# EAGLE design eib-64-nanoz-adapter (EAGLE 8.3.2)
DESIGNER: JPN@MIT; DESIGN_NAME: EIB-64 NanoZ Adapter; LICENSE: CERN OHL v1.2; REVISION: 1.1
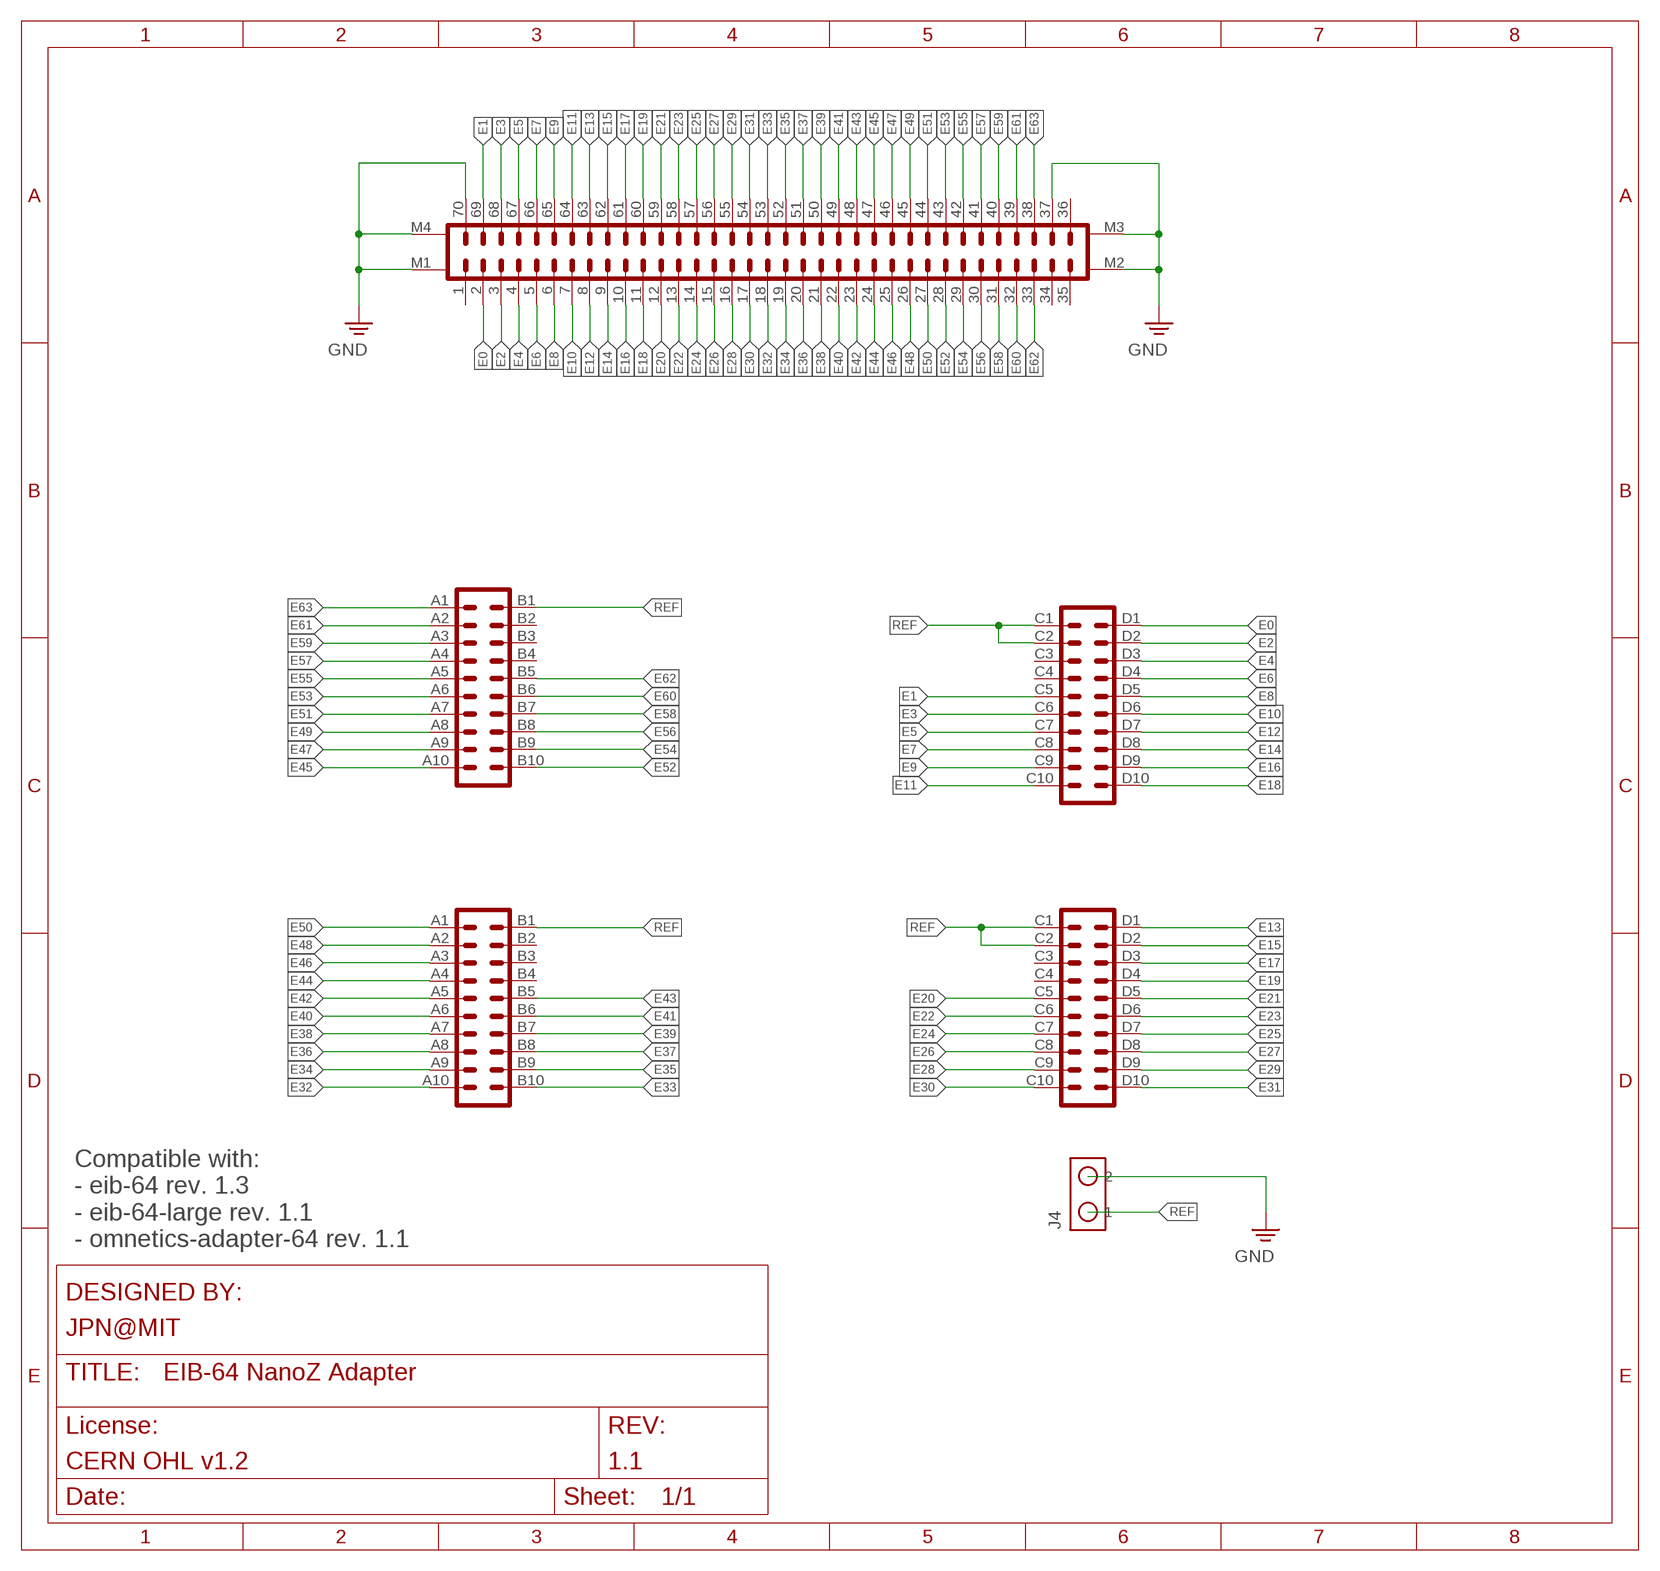
[diagram p0: schematic, sheet 1]

## Parts
J1  DF40-REC  PINHD-2X35+4_DF40-70HEAD  [DF40-70HEAD]
J2  PINHD-4X10_MOLC-THRU  [MOLC-110-11-S-Q]
J3  PINHD-4X10_MOLC-THRU  [MOLC-110-11-S-Q]
J4  SCREW2  [SCREW2]

## Nets
E0: J1.2 J2.D1
E1: J1.69 J2.C5
E2: J1.3 J2.D2
E3: J1.68 J2.C6
E4: J1.4 J2.D3
E5: J1.67 J2.C7
E6: J1.5 J2.D4
E7: J1.66 J2.C8
E8: J1.6 J2.D5
E9: J1.65 J2.C9
E10: J1.7 J2.D6
E11: J1.64 J2.C10
E12: J1.8 J2.D7
E13: J1.63 J3.D1
E14: J1.9 J2.D8
E15: J1.62 J3.D2
E16: J1.10 J2.D9
E17: J1.61 J3.D3
E18: J1.11 J2.D10
E19: J1.60 J3.D4
E20: J1.12 J3.C5
E21: J1.59 J3.D5
E22: J1.13 J3.C6
E23: J1.58 J3.D6
E24: J1.14 J3.C7
E25: J1.57 J3.D7
E26: J1.15 J3.C8
E27: J1.56 J3.D8
E28: J1.16 J3.C9
E29: J1.55 J3.D9
E30: J1.17 J3.C10
E31: J1.54 J3.D10
E32: J1.18 J3.A10
E33: J1.53 J3.B10
E34: J1.19 J3.A9
E35: J1.52 J3.B9
E36: J1.20 J3.A8
E37: J1.51 J3.B8
E38: J1.21 J3.A7
E39: J1.50 J3.B7
E40: J1.22 J3.A6
E41: J1.49 J3.B6
E42: J1.23 J3.A5
E43: J1.48 J3.B5
E44: J1.24 J3.A4
E45: J1.47 J2.A10
E46: J1.25 J3.A3
E47: J1.46 J2.A9
E48: J1.26 J3.A2
E49: J1.45 J2.A8
E50: J1.27 J3.A1
E51: J1.44 J2.A7
E52: J1.28 J2.B10
E53: J1.43 J2.A6
E54: J1.29 J2.B9
E55: J1.42 J2.A5
E56: J1.30 J2.B8
E57: J1.41 J2.A4
E58: J1.31 J2.B7
E59: J1.40 J2.A3
E60: J1.32 J2.B6
E61: J1.39 J2.A2
E62: J1.33 J2.B5
E63: J1.38 J2.A1
GND: J1.37 J1.70 J1.M1 J1.M2 J1.M3 J1.M4 J4.P$2
REF: J2.B1 J2.C1 J2.C2 J3.B1 J3.C1 J3.C2 J4.P$1
Unconnected: J1.1 J1.34 J1.35 J1.36 J2.B2 J2.B3 J2.B4 J2.C3 J2.C4 J3.B2 J3.B3 J3.B4 J3.C3 J3.C4

## Notes on the sheet
- Compatible with:
  - eib-64 rev. 1.3
  - eib-64-large rev. 1.1
  - omnetics-adapter-64 rev. 1.1

## Library data of the parts
J1 = jonnew:PINHD-2X35+4
J2 J3 = jonnew:PINHD-4X10
J4 = jonnew:SCREW2: Screw Terminal

## Net classes
1 thick: width 0.102 mm

## Board
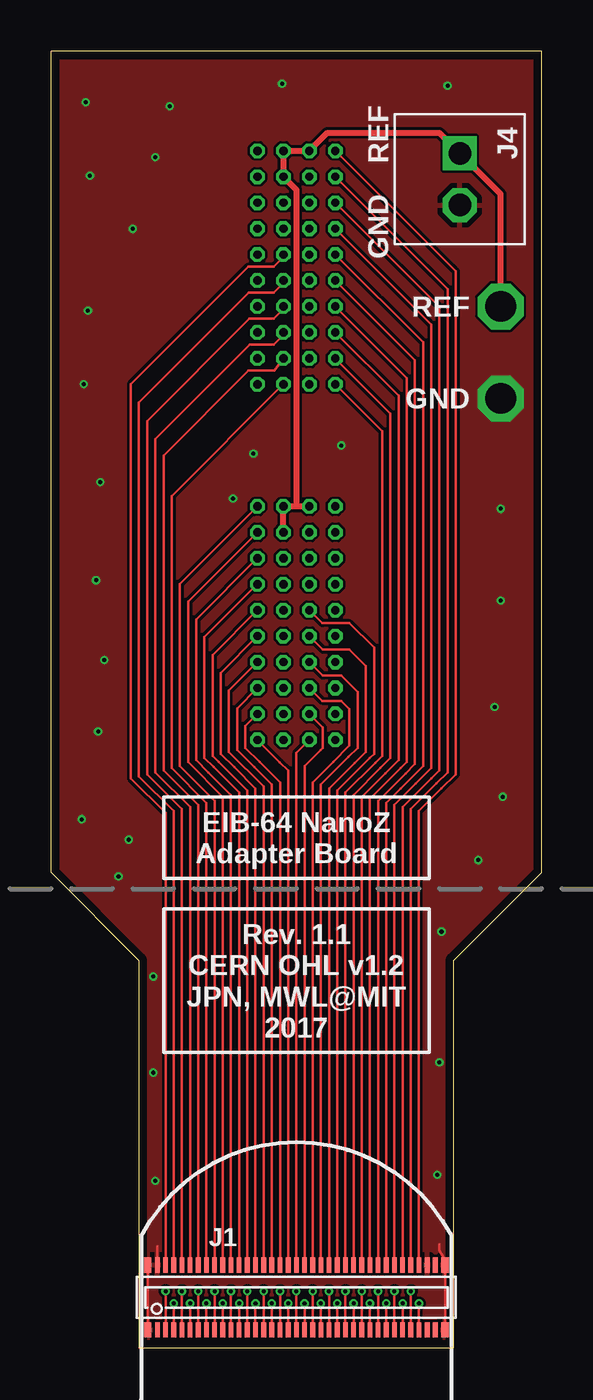
[diagram p1: board, top side]
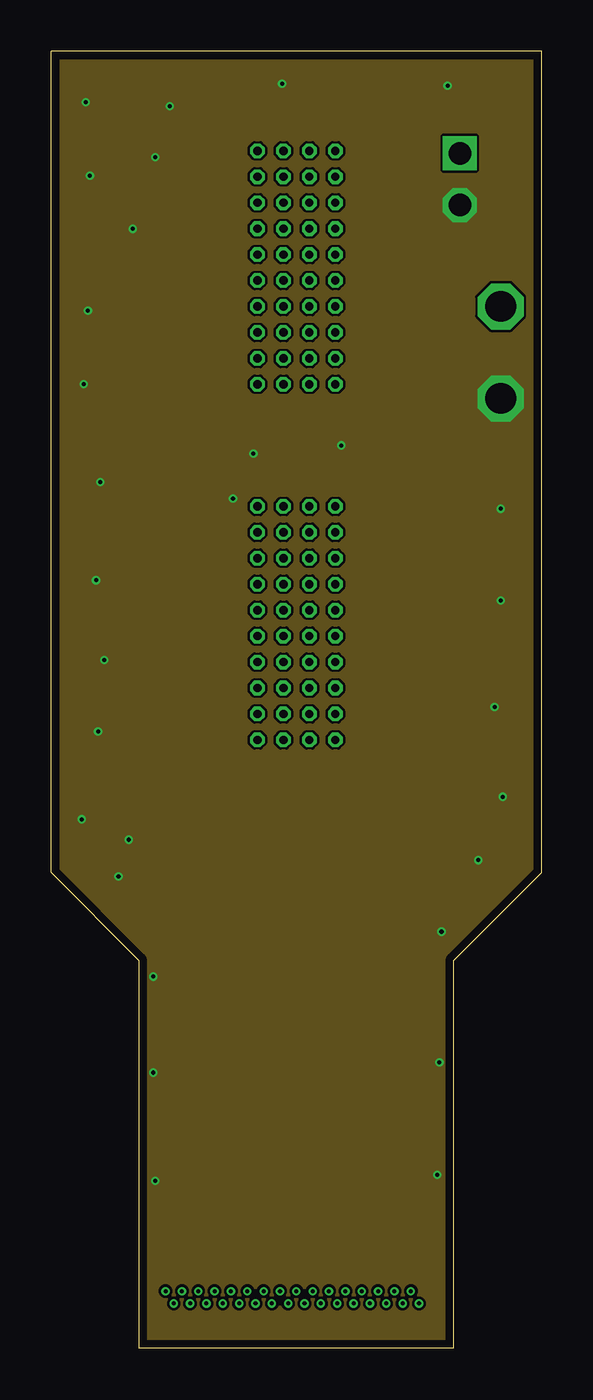
[diagram p2: board, inner layer Route2]
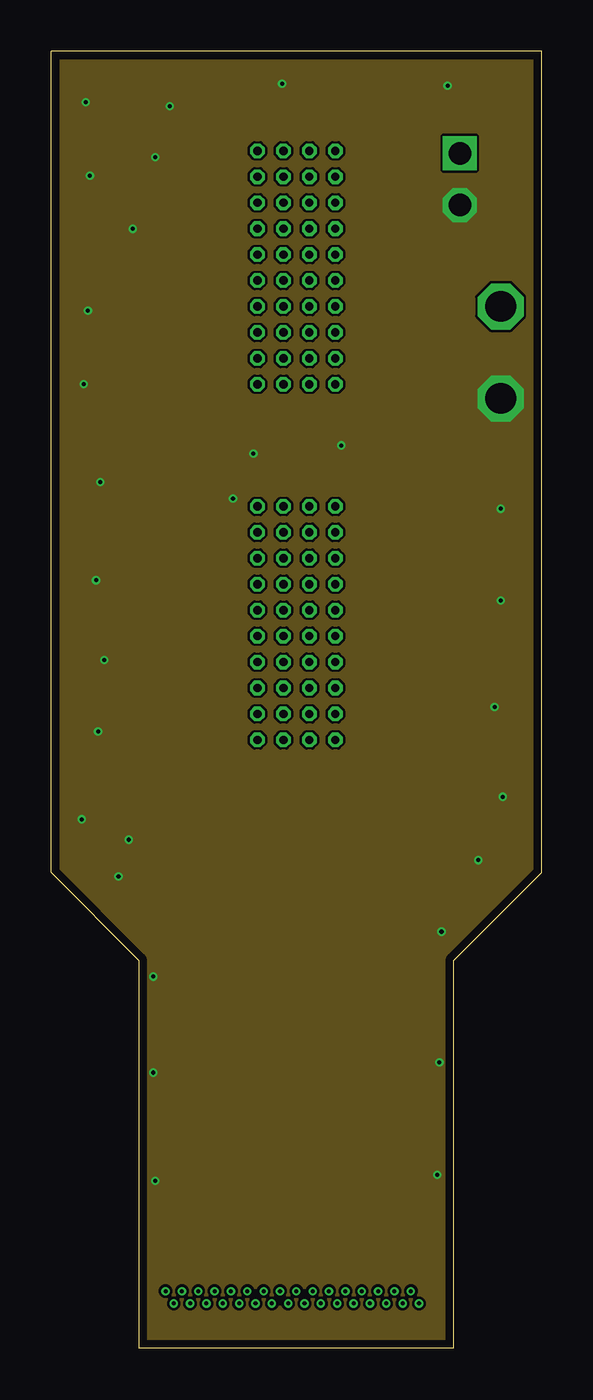
[diagram p3: board, inner layer Route15]
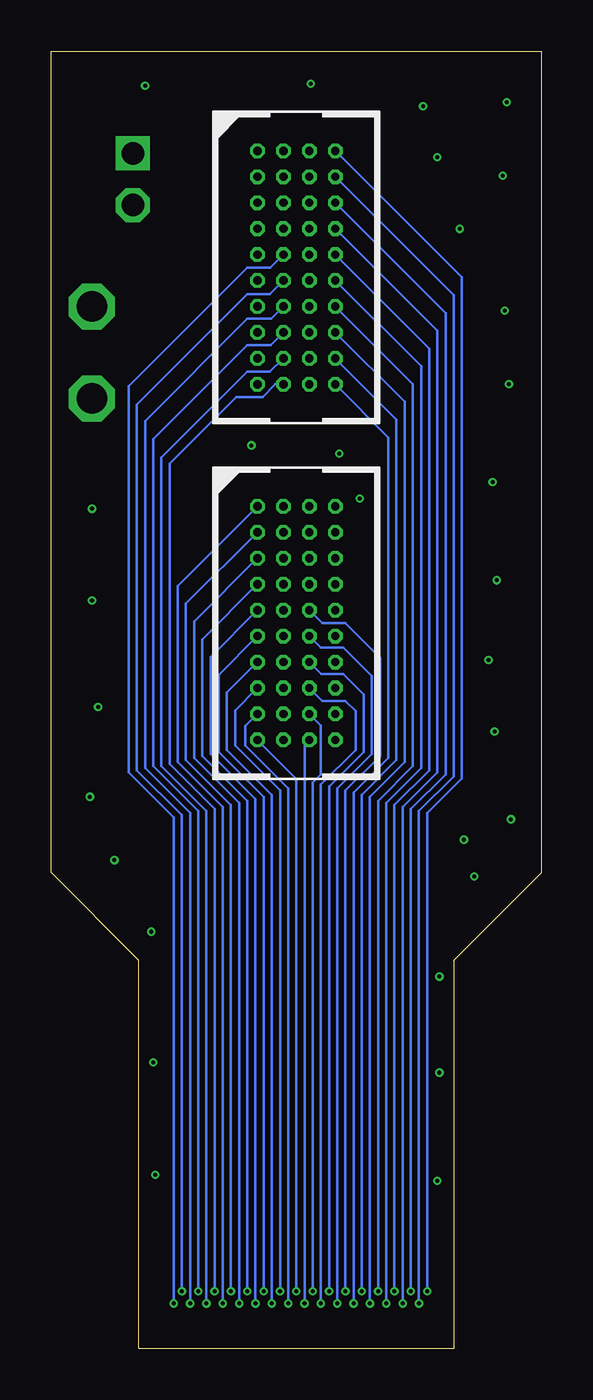
[diagram p4: board, bottom side, seen from below]

Size 24 x 63.5 mm. Coordinates in mm from the lower left corner, seen from the top.
Outline: 19.7,0 19.7,19 24,23.3 24,63.5 0,63.5 0,23.3 4.3,19 4.3,0 19.7,0
Copper layers (1*2*15*16): Top 0.035mm / dielectric 0.2mm / Route2 0.0175mm / dielectric 0.3mm / Route15 0.0175mm / dielectric 0.2mm / Bottom 0.035mm
Design rules "seeed-studio-4-layer *": minimum track width 5mil, minimum drill 0.2mm, track to track 5mil, track to pad 5mil, pad to pad 5mil, via to via 5mil, smd to smd 0mil, copper to edge 0.4mm, drill to drill 10mil, minimum pad ring 6mil, minimum via ring 4mil, stop-mask expansion 4mil, vias tented up to drill 100mil, thermal gap 10mil

### Footprints (pad centres in the part's own frame; a part is rotated, then mirrored left to right if it is on the bottom)
DF40-70HEAD = smd 0.23 x 0.75: 1 -6.8,-1.585; 2 -6.4,-1.585; 3 -6,-1.585; 4 -5.6,-1.585; 5 -5.2,-1.585; 6 -4.8,-1.585; 7 -4.4,-1.585; 8 -4,-1.585; 9 -3.6,-1.585; 10 -3.2,-1.585; 11 -2.8,-1.585; 12 -2.4,-1.585; 13 -2,-1.585; 14 -1.6,-1.585; 15 -1.2,-1.585; 16 -0.8,-1.585; 17 -0.4,-1.585; 18 0,-1.585; 19 0.4,-1.585; 20 0.8,-1.585; 21 1.2,-1.585; 22 1.6,-1.585; 23 2,-1.585; 24 2.4,-1.585; 25 2.8,-1.585; 26 3.2,-1.585; 27 3.6,-1.585; 28 4,-1.585; 29 4.4,-1.585; 30 4.8,-1.585; 31 5.2,-1.585; 32 5.6,-1.585; 33 6,-1.585; 34 6.4,-1.585; 35 6.8,-1.585; 36 6.8,1.585; 37 6.4,1.585; 38 6,1.585; 39 5.6,1.585; 40 5.2,1.585; 41 4.8,1.585; 42 4.4,1.585; 43 4,1.585; 44 3.6,1.585; 45 3.2,1.585; 46 2.8,1.585; 47 2.4,1.585; 48 2,1.585; 49 1.6,1.585; 50 1.2,1.585; 51 0.8,1.585; 52 0.4,1.585; 53 0,1.585; 54 -0.4,1.585; 55 -0.8,1.585; 56 -1.2,1.585; 57 -1.6,1.585; 58 -2,1.585; 59 -2.4,1.585; 60 -2.8,1.585; 61 -3.2,1.585; 62 -3.6,1.585; 63 -4,1.585; 64 -4.4,1.585; 65 -4.8,1.585; 66 -5.2,1.585; 67 -5.6,1.585; 68 -6,1.585; 69 -6.4,1.585; 70 -6.8,1.585 | smd 0.35 x 0.75: M1 -7.275,-1.585; M2 7.275,-1.585; M3 7.275,1.585; M4 -7.275,1.585
MOLC-110-11-S-Q = drill 0.406 octagon: A1 -1.905,5.715; A2 -1.905,4.445; A3 -1.905,3.175; A4 -1.905,1.905; A5 -1.905,0.635; A6 -1.905,-0.635; A7 -1.905,-1.905; A8 -1.905,-3.175; A9 -1.905,-4.445; A10 -1.905,-5.715; B1 -0.635,5.715; B2 -0.635,4.445; B3 -0.635,3.175; B4 -0.635,1.905; B5 -0.635,0.635; B6 -0.635,-0.635; B7 -0.635,-1.905; B8 -0.635,-3.175; B9 -0.635,-4.445; B10 -0.635,-5.715; C1 0.635,5.715; C2 0.635,4.445; C3 0.635,3.175; C4 0.635,1.905; C5 0.635,0.635; C6 0.635,-0.635; C7 0.635,-1.905; C8 0.635,-3.175; C9 0.635,-4.445; C10 0.635,-5.715; D1 1.905,5.715; D2 1.905,4.445; D3 1.905,3.175; D4 1.905,1.905; D5 1.905,0.635; D6 1.905,-0.635; D7 1.905,-1.905; D8 1.905,-3.175; D9 1.905,-4.445; D10 1.905,-5.715
SCREW2 = drill 1.1 square: P$1 0,0 | drill 1.1 octagon: P$2 2.54,0

### Placement (x,y rotation side)
J1  12,2.5 0 top
J2  12,52.9 0 bottom
J3  12,35.5 0 bottom
J4  20,58.5 270 top

### Tracks (layer width: path | path; a pad name or v marks a point on that pad's centre or on a via)
E0  (via drill 0.2)
  Top 0.127: v5.6,2.8 J1.2
  Bottom 0.127: J2.D1 3.9,52.42 3.9,27.9 5.6,26.2 v5.6,2.8
E1
  Top 0.127: J2.C5 11.49,53.54 10.89,52.94 9.64,52.94 3.9,47.2 3.9,27.9 5.6,26.2 J1.69
E2  (via drill 0.2)
  Top 0.127: v6,2.2 J1.3
  Bottom 0.127: J2.D2 4.3,51.55 4.3,28 6,26.3 v6,2.2
E3
  Top 0.127: J2.C6 11.49,52.27 10.89,51.67 9.67,51.67 4.3,46.3 4.3,28 6,26.3 J1.68
E4  (via drill 0.2)
  Top 0.127: J1.4 v6.4,2.8
  Bottom 0.127: J2.D3 4.7,50.68 4.7,28.1 6.4,26.4 v6.4,2.8
E5
  Top 0.127: J2.C7 11.49,51 10.89,50.4 9.7,50.4 4.7,45.4 4.7,28.1 | 4.7,28.1 6.4,26.4 | J1.67 6.4,26.4 | 6.4,26.4 4.7,28.1
E6  (via drill 0.2)
  Top 0.127: J1.5 v6.8,2.2
  Bottom 0.127: J2.D4 5.1,49.81 5.1,28.2 6.8,26.5 v6.8,2.2
E7
  Top 0.127: J2.C8 11.49,49.73 10.89,49.13 9.73,49.13 5.1,44.5 5.1,28.2 | 5.1,28.2 6.8,26.5 | J1.66 6.8,26.5 | 6.8,26.5 5.1,28.2
E8  (via drill 0.2)
  Top 0.127: J1.6 v7.2,2.8
  Bottom 0.127: J2.D5 5.5,48.94 5.5,28.3 7.2,26.6 v7.2,2.8
E9
  Top 0.127: J2.C9 10.93,47.86 9.66,47.86 5.5,43.7 5.5,28.3 7.2,26.6 J1.65
E10  (via drill 0.2)
  Top 0.127: J1.7 v7.6,2.2
  Bottom 0.127: J2.D6 5.9,48.07 5.9,28.4 7.6,26.7 v7.6,2.2
E11
  Top 0.127: J2.C10 5.9,41.72 5.9,28.4 7.6,26.7 J1.64
E12  (via drill 0.2)
  Top 0.127: J1.8 v8,2.8
  Bottom 0.127: J2.D7 6.3,47.2 6.3,28.5 8,26.8 v8,2.8
E13
  Top 0.127: J3.D1 6.3,37.42 6.3,28.5 8,26.8 J1.63
E14  (via drill 0.2)
  Top 0.127: J1.9 v8.4,2.2
  Bottom 0.127: J2.D8 6.7,46.33 6.7,28.7 8.4,27 v8.4,2.2
E15
  Top 0.127: J3.D2 6.7,36.55 6.7,28.7 8.4,27 J1.62
E16  (via drill 0.2)
  Top 0.127: J1.10 v8.8,2.8
  Bottom 0.127: 8.8,5 8.8,27.1 7.1,28.8 7.1,45.46 J2.D9 | 8.8,5 8.8,4.9 | v8.8,2.8 8.8,5
E17
  Top 0.127: J3.D3 7.1,35.68 7.1,28.8 7.7,28.2 | 7.7,28.2 8.8,27.1 | J1.61 8.8,27.1 | 8.8,27.1 7.7,28.2
E18  (via drill 0.2)
  Top 0.127: J1.11 v9.2,2.2
  Bottom 0.127: J2.D10 7.5,44.59 7.5,28.9 9.2,27.2 v9.2,2.2
E19
  Top 0.127: J3.D4 7.5,34.81 7.5,28.9 7.95,28.45 | 7.95,28.45 9.2,27.2 | J1.60 9.2,27.2 | 9.2,27.2 7.95,28.45
E20  (via drill 0.2)
  Top 0.127: J1.12 v9.6,2.8
  Bottom 0.127: J3.C5 10.73,35.5 9.6,35.5 7.9,33.8 7.9,29 9.6,27.3 v9.6,2.8
E21
  Top 0.127: J3.D5 7.9,33.94 7.9,29 8.2,28.7 | 8.2,28.7 9.6,27.3 | J1.59 9.6,27.3 | 9.6,27.3 8.2,28.7
E22  (via drill 0.2)
  Top 0.127: J1.13 v10,2.2
  Bottom 0.127: J3.C6 10.8,34.3 9.7,34.3 8.3,32.9 8.3,29.1 10,27.4 v10,2.2
E23
  Top 0.127: J3.D6 8.3,33.07 8.3,29.1 8.95,28.45 | 8.95,28.45 10,27.4 | J1.58 10,27.4 | 10,27.4 8.95,28.45
E24  (via drill 0.2)
  Top 0.127: J1.14 v10.4,2.8
  Bottom 0.127: J3.C7 10.77,33 9.7,33 8.7,32 8.7,29.2 10.4,27.5 v10.4,2.8
E25
  Top 0.127: J3.D7 8.7,32.2 8.7,29.2 | 8.7,29.2 10.4,27.5 | J1.57 10.4,27.5 | 10.4,27.5 8.7,29.2
E26  (via drill 0.2)
  Top 0.127: J1.15 v10.8,2.2
  Bottom 0.127: J3.C8 10.74,31.7 9.6,31.7 9.1,31.2 9.1,29.3 10.8,27.6 v10.8,2.2
E27
  Top 0.127: J3.D8 9.1,31.33 9.1,29.3 9.95,28.45 | 9.95,28.45 10.8,27.6 | J1.56 10.8,27.6 | 10.8,27.6 9.95,28.45
E28  (via drill 0.2)
  Top 0.127: J1.16 v11.2,2.8
  Bottom 0.127: J3.C9 10.8,30.49 10.8,28.1 11.2,27.7 v11.2,2.8
E29
  Top 0.127: J3.D9 9.5,30.46 9.5,29.4 10.2,28.7 | 10.2,28.7 11.2,27.7 | J1.55 11.2,27.7 | 11.2,27.7 10.2,28.7
E30  (via drill 0.2)
  Top 0.127: J1.17 v11.6,2.2
  Bottom 0.127: J3.C10 11.6,29.55 v11.6,2.2
E31
  Top 0.127: 11.19,28.69 J3.D10 | 11.19,28.69 11.6,28.28 | J1.54 11.6,28.28 | 11.6,28.28 11.19,28.69
E32  (via drill 0.2)
  Top 0.127: J1.18 v12,2.8
  Bottom 0.127: J3.A10 12,27.88 v12,2.8
E33
  Top 0.127: 12,29.15 J3.B10 12,29.15 | J1.53 12,29.15
E34  (via drill 0.2)
  Top 0.127: J1.19 v12.4,2.2
  Bottom 0.127: J3.A9 14.5,30.46 14.5,29.5 12.4,27.4 v12.4,2.2
E35
  Top 0.127: J3.B9 13.3,30.39 13.3,29.4 13.2,29.3 | 13.2,29.3 12.4,28.5 | J1.52 12.4,28.5 | 12.4,28.5 13.2,29.3
E36  (via drill 0.2)
  Top 0.127: J1.20 v12.8,2.8
  Bottom 0.127: J3.A8 15,31.23 15,29.5 12.8,27.3 v12.8,2.8
E37
  Top 0.127: J3.B8 13.26,31.7 14.2,31.7 14.6,31.3 14.6,29.5 13.8,28.7 | 13.8,28.7 12.8,27.7 | J1.51 12.8,27.7 | 12.8,27.7 13.8,28.7
E38  (via drill 0.2)
  Top 0.127: J1.21 v13.2,2.2
  Bottom 0.127: J3.A7 15.4,32.1 15.4,29.3 13.2,27.1 v13.2,2.2
E39
  Top 0.127: J3.B7 13.29,32.94 14.2,32.94 15,32.13 15,29.4 14.55,28.95 | 14.55,28.95 13.2,27.6 | J1.50 13.2,27.6 | 13.2,27.6 14.55,28.95
E40  (via drill 0.2)
  Top 0.127: J1.22 v13.6,2.79 v13.59,2.8
  Bottom 0.127: J3.A6 15.8,32.97 15.8,29.2 13.6,27 13.6,4.9 13.59,4.89 v13.59,2.8
E41
  Top 0.127: J3.B6 13.29,34.2 13.3,34.2 14.6,34.2 15.4,33.4 15.4,29.2 14.85,28.65 | 14.85,28.65 13.6,27.4 | J1.49 13.6,27.4 | 13.6,27.4 14.85,28.65
E42  (via drill 0.2)
  Top 0.127: J1.23 v14,2.2
  Bottom 0.127: J3.A5 16.2,33.84 16.2,29.1 14,26.9 v14,2.2
E43
  Top 0.127: J3.B5 | J3.B5 13.27,35.5 14.6,35.5 15.8,34.3 15.8,29.1 15.6,28.9 | 15.6,28.9 14,27.3 | J1.48 14,27.3 | 14,27.3 15.6,28.9
E44  (via drill 0.2)
  Top 0.127: J1.24 v14.4,2.8
  Bottom 0.127: J3.A4 16.6,34.71 16.6,29 14.4,26.8 v14.4,2.8
E45
  Top 0.127: J2.A10 16.2,44.89 16.2,29 15.85,28.65 | 15.85,28.65 14.4,27.2 | J1.47 14.4,27.2 | 14.4,27.2 15.85,28.65
E46  (via drill 0.2)
  Top 0.127: J1.25 v14.8,2.2
  Bottom 0.127: J3.A3 17,35.58 17,28.9 14.8,26.7 v14.8,2.2
E47
  Top 0.127: J2.A9 16.6,45.76 16.6,28.9 16.1,28.4 | 16.1,28.4 14.8,27.1 | J1.46 14.8,27.1 | 14.8,27.1 16.1,28.4
E48  (via drill 0.2)
  Top 0.127: J1.26 v15.2,2.8
  Bottom 0.127: J3.A2 17.4,36.45 17.4,28.8 15.2,26.6 v15.2,2.8
E49
  Top 0.127: J2.A8 17,46.63 17,28.8 16.35,28.15 | 16.35,28.15 15.2,27 | J1.45 15.2,27 | 15.2,27 16.35,28.15
E50  (via drill 0.2)
  Top 0.127: J1.27 v15.6,2.2
  Bottom 0.127: J3.A1 17.8,37.32 17.8,28.7 15.6,26.5 v15.6,2.2
E51
  Top 0.127: J2.A7 17.4,47.5 17.4,28.7 17.1,28.4 | 17.1,28.4 15.6,26.9 | J1.44 15.6,26.9 | 15.6,26.9 17.1,28.4
E52  (via drill 0.2)
  Top 0.127: J1.28 v16,2.8
  Bottom 0.127: J2.B10 13.03,47.19 13.65,46.57 14.93,46.57 18.2,43.3 18.2,28.6 16,26.4 v16,2.8
E53
  Top 0.127: J2.A6 17.8,48.37 17.8,28.6 17.35,28.15 | 17.35,28.15 16,26.8 | J1.43 16,26.8 | 16,26.8 17.35,28.15
E54  (via drill 0.2)
  Top 0.127: J1.29 v16.4,2.2
  Bottom 0.127: J2.B9 13.3,47.8 14.4,47.8 18.6,43.6 18.6,28.5 16.4,26.3 v16.4,2.2
E55
  Top 0.127: J2.A5 18.2,49.24 18.2,28.5 17.1,27.4 | 17.1,27.4 16.4,26.7 | J1.42 16.4,26.7 | 16.4,26.7 17.1,27.4
E56  (via drill 0.2)
  Top 0.127: J1.30 v16.8,2.8
  Bottom 0.127: J2.B8 13.26,49.1 14.4,49.1 19,44.5 19,28.5 16.8,26.3 v16.8,2.8
E57
  Top 0.127: J2.A4 18.6,50.11 18.6,28.4 17.85,27.65 | 17.85,27.65 16.8,26.6 | J1.41 16.8,26.6 | 16.8,26.6 17.85,27.65
E58  (via drill 0.2)
  Top 0.127: J1.31 v17.2,2.2
  Bottom 0.127: J2.B7 13.23,50.4 14.4,50.4 19.4,45.4 19.4,28.4 17.2,26.2 v17.2,2.2
E59
  Top 0.127: J2.A3 19,50.98 19,28.3 18.6,27.9 | 18.6,27.9 17.2,26.5 | J1.40 17.2,26.5 | 17.2,26.5 18.6,27.9
E60  (via drill 0.2)
  Top 0.127: J1.32 v17.6,2.8
  Bottom 0.127: J2.B6 13.3,51.6 14.4,51.6 19.8,46.2 19.8,28.3 17.6,26.1 v17.6,2.8
E61
  Top 0.127: J2.A2 19.4,51.85 19.4,28.2 18.85,27.65 | 18.85,27.65 17.6,26.4 | J1.39 17.6,26.4 | 17.6,26.4 18.85,27.65
E62  (via drill 0.2)
  Top 0.127: J1.33 v18,2.2
  Bottom 0.127: J2.B5 13.27,52.9 14.4,52.9 20.2,47.1 20.2,28.2 18,26 v18,2.2
E63
  Top 0.127: J2.A1 19.8,52.72 19.8,28.1 19.1,27.4 | 19.1,27.4 18,26.3 | J1.38 18,26.3 | 18,26.3 19.1,27.4
GND  (via drill 0.2, 1.5)
  Top 0.127: J1.M1 J1.M4 | J1.M2 J1.M3 19.27,4.32 19,4.8 19,5.1 | J1.70 5.2,5
  other vias: 22,46.5 20.9,23.9 22.1,27 21.7,31.4 22,36.6 22,41.1 2.2,37.6 2.3,30.2 3.3,23.1 3.8,24.9 1.6,47.2 4,54.8 1.7,61 11.3,61.9 5.8,60.8 19.4,61.8 14.2,44.2 9.9,43.8 8.9,41.6 1.5,25.9 2.6,33.7 2.4,42.4 1.8,50.8 1.9,57.4 5.1,58.3 5.1,8.2 18.9,8.5 19,14 19.1,20.4 5,18.2 5,13.5
  pour Top (rank 3): -4,67.5 26,67.5 26,-9.5 -4,-9.5
  pour Route2 (rank 3, no thermals): -2.7,66.6 27.3,66.6 27.3,-10.4 -2.7,-10.4
  pour Route15 (rank 3, no thermals): -5.4,68.4 24.6,68.4 24.6,-8.6 -5.4,-8.6
REF  (via drill 1.5)
  Top 0.305: 12,41.22 12,56.71 J2.C2 J2.C1 J2.B1 13.52,59.5 19,59.5 J4.P$1 22,56.5 v22,51 | J3.B1 12,41.22 | 12,41.22 J3.C1 J3.C2

### Text on the board
tPlace: REF | GND | REF | GND | EIB-64 NanoZ / Adapter Board | Rev. 1.1 / CERN OHL v1.2 / JPN, MWL@MIT / 2017